# Altium schematic sheet top.SchDoc
size A
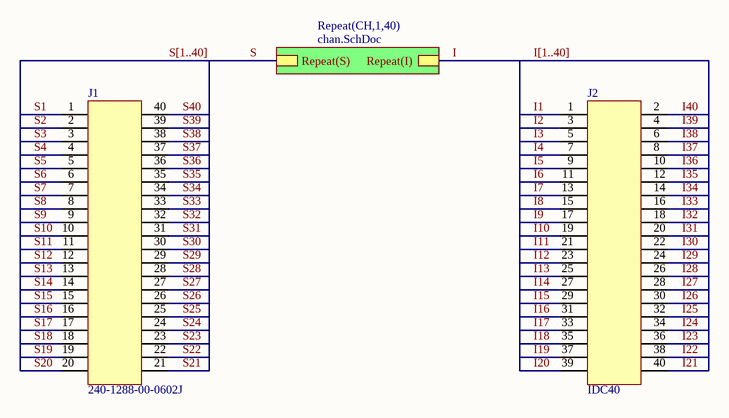
[diagram p0: top.SchDoc]

## Parts
J1  240-1288-00-0602J  [240-1300-00-0602J]
J2  IDC40  [IDC40]

## Sub-sheets
Repeat(CH,1,40) = chan.SchDoc: Repeat(I), Repeat(S)

## Nets
I: sheet Repeat(CH,1,40)/Repeat(I)
I1: J2.1
I2: J2.3
I3: J2.5
I4: J2.7
I5: J2.9
I6: J2.11
I7: J2.13
I8: J2.15
I9: J2.17
I10: J2.19
I11: J2.21
I12: J2.23
I13: J2.25
I14: J2.27
I15: J2.29
I16: J2.31
I17: J2.33
I18: J2.35
I19: J2.37
I20: J2.39
I21: J2.40
I22: J2.38
I23: J2.36
I24: J2.34
I25: J2.32
I26: J2.30
I27: J2.28
I28: J2.26
I29: J2.24
I30: J2.22
I31: J2.20
I32: J2.18
I33: J2.16
I34: J2.14
I35: J2.12
I36: J2.10
I37: J2.8
I38: J2.6
I39: J2.4
I40: J2.2
S: sheet Repeat(CH,1,40)/Repeat(S)
S1: J1.1
S2: J1.2
S3: J1.3
S4: J1.4
S5: J1.5
S6: J1.6
S7: J1.7
S8: J1.8
S9: J1.9
S10: J1.10
S11: J1.11
S12: J1.12
S13: J1.13
S14: J1.14
S15: J1.15
S16: J1.16
S17: J1.17
S18: J1.18
S19: J1.19
S20: J1.20
S21: J1.21
S22: J1.22
S23: J1.23
S24: J1.24
S25: J1.25
S26: J1.26
S27: J1.27
S28: J1.28
S29: J1.29
S30: J1.30
S31: J1.31
S32: J1.32
S33: J1.33
S34: J1.34
S35: J1.35
S36: J1.36
S37: J1.37
S38: J1.38
S39: J1.39
S40: J1.40

## Buses and harness runs
bus I[1..40]
bus S[1..40]

## Library data of the parts
J1 = 240-1288-00-0602J: DIP40 ZIF